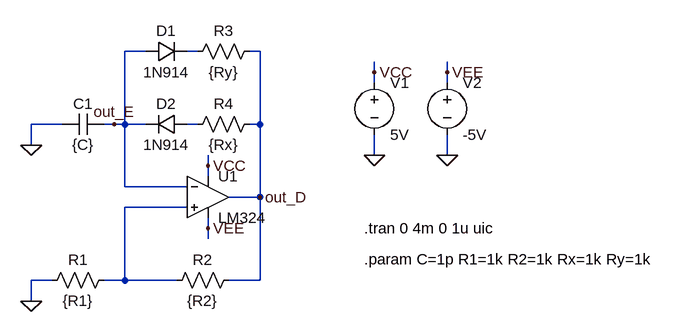
[diagram p0: schematic astabil.asc]
astabil.asc, the LTspice schematic file:
Version 4
SHEET 1 880 680
WIRE 16 48 -16 48
WIRE 96 48 80 48
WIRE 192 48 176 48
WIRE 368 80 368 64
WIRE 480 80 480 64
WIRE 368 96 368 80
WIRE 480 96 480 80
WIRE -112 160 -160 160
WIRE -32 160 -48 160
WIRE -16 160 -16 48
WIRE -16 160 -32 160
WIRE 16 160 -16 160
WIRE 96 160 80 160
WIRE 192 160 192 48
WIRE 192 160 176 160
WIRE -160 192 -160 160
WIRE 368 208 368 176
WIRE 480 208 480 176
WIRE 112 224 112 208
WIRE 112 240 112 224
WIRE -16 256 -16 160
WIRE 80 256 -16 256
WIRE 192 272 192 160
WIRE 192 272 144 272
WIRE 80 288 -16 288
WIRE 112 320 112 304
WIRE 112 336 112 320
WIRE -128 400 -160 400
WIRE -16 400 -16 288
WIRE -16 400 -48 400
WIRE 64 400 -16 400
WIRE 192 400 192 272
WIRE 192 400 144 400
WIRE -160 432 -160 400
FLAG -160 432 0
FLAG -160 192 0
FLAG 368 208 0
FLAG 480 208 0
FLAG 112 224 VCC
FLAG 368 80 VCC
FLAG 112 320 VEE
FLAG 480 80 VEE
FLAG 192 272 out_D
FLAG -32 160 out_E
SYMBOL res -32 384 R90
WINDOW 0 0 56 VBottom 2
WINDOW 3 32 56 VTop 2
SYMATTR InstName R1
SYMATTR Value {R1}
SYMBOL res 192 32 R90
WINDOW 0 0 56 VBottom 2
WINDOW 3 32 56 VTop 2
SYMATTR InstName R3
SYMATTR Value {Ry}
SYMBOL res 160 384 R90
WINDOW 0 0 56 VBottom 2
WINDOW 3 32 56 VTop 2
SYMATTR InstName R2
SYMATTR Value {R2}
SYMBOL cap -48 144 R90
WINDOW 0 0 32 VBottom 2
WINDOW 3 32 32 VTop 2
SYMATTR InstName C1
SYMATTR Value {C}
SYMBOL voltage 368 80 R0
WINDOW 123 0 0 Left 2
WINDOW 39 0 0 Left 2
SYMATTR InstName V1
SYMATTR Value 5V
SYMBOL voltage 480 80 R0
WINDOW 123 0 0 Left 2
WINDOW 39 0 0 Left 2
SYMATTR InstName V2
SYMATTR Value -5V
SYMBOL res 192 144 R90
WINDOW 0 0 56 VBottom 2
WINDOW 3 32 56 VTop 2
SYMATTR InstName R4
SYMATTR Value {Rx}
SYMBOL diode 16 32 M90
WINDOW 0 0 32 VBottom 2
WINDOW 3 32 32 VTop 2
SYMATTR InstName D1
SYMATTR Value 1N914
SYMBOL diode 80 176 M270
WINDOW 0 32 32 VTop 2
WINDOW 3 0 32 VBottom 2
SYMATTR InstName D2
SYMATTR Value 1N914
SYMBOL LM324 112 208 R0
SYMATTR InstName U1
TEXT 352 320 Left 2 !.tran 0 4m 0 1u uic
TEXT 352 368 Left 2 !.param C=1p R1=1k R2=1k Rx=1k Ry=1k

The netlist it stands for:
* astabil.asc
R1 N003 0 {R1}
R3 out_D N001 {Ry}
R2 out_D N003 {R2}
C1 out_E 0 {C}
V1 VCC 0 5V
V2 VEE 0 -5V
R4 out_D N002 {Rx}
D1 out_E N001 1N914
D2 N002 out_E 1N914
* U1: LM324 (symbol LM324 not available, pins judged from their places): In+=N003 In-=out_E V+=VCC V-=VEE OUT=out_D
.model D D
.lib standard.dio
.tran 0 4m 0 1u uic
.param C=1p R1=1k R2=1k Rx=1k Ry=1k
.backanno
.end